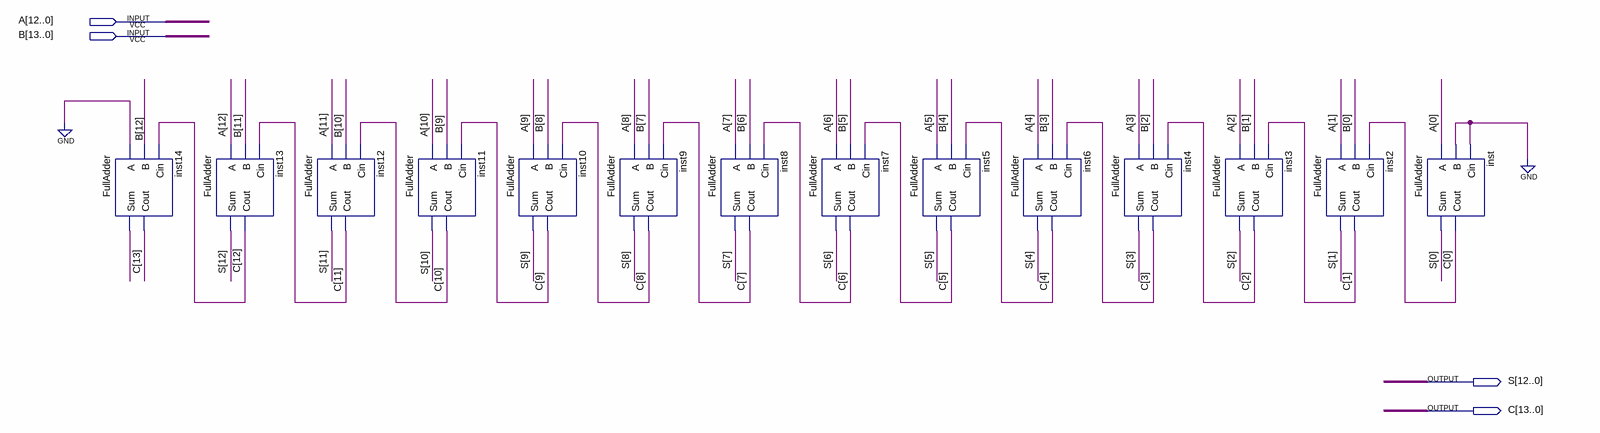
[diagram p0: schematic sheet]
// Quartus schematic CRA_wordslice.bdf as structural Verilog: 14 symbols, 4 pins
module CRA_wordslice (
  input  [12:0] A,
  input  [13:0] B,
  output [12:0] S,
  output [13:0] C
);

  wire inst14_sum;

  FullAdder inst14 (.A(1'b0), .B(B[12]), .Cin(C[12]), .Sum(inst14_sum), .Cout(C[13]));
  FullAdder inst13 (.A(A[12]), .B(B[11]), .Cin(C[11]), .Sum(S[12]), .Cout(C[12]));
  FullAdder inst12 (.A(A[11]), .B(B[10]), .Cin(C[10]), .Sum(S[11]), .Cout(C[11]));
  FullAdder inst11 (.A(A[10]), .B(B[9]), .Cin(C[9]), .Sum(S[10]), .Cout(C[10]));
  FullAdder inst10 (.A(A[9]), .B(B[8]), .Cin(C[8]), .Sum(S[9]), .Cout(C[9]));
  FullAdder inst9 (.A(A[8]), .B(B[7]), .Cin(C[7]), .Sum(S[8]), .Cout(C[8]));
  FullAdder inst8 (.A(A[7]), .B(B[6]), .Cin(C[6]), .Sum(S[7]), .Cout(C[7]));
  FullAdder inst7 (.A(A[6]), .B(B[5]), .Cin(C[5]), .Sum(S[6]), .Cout(C[6]));
  FullAdder inst5 (.A(A[5]), .B(B[4]), .Cin(C[4]), .Sum(S[5]), .Cout(C[5]));
  FullAdder inst6 (.A(A[4]), .B(B[3]), .Cin(C[3]), .Sum(S[4]), .Cout(C[4]));
  FullAdder inst4 (.A(A[3]), .B(B[2]), .Cin(C[2]), .Sum(S[3]), .Cout(C[3]));
  FullAdder inst3 (.A(A[2]), .B(B[1]), .Cin(C[1]), .Sum(S[2]), .Cout(C[2]));
  FullAdder inst2 (.A(A[1]), .B(B[0]), .Cin(C[0]), .Sum(S[1]), .Cout(C[1]));
  FullAdder inst (.A(A[0]), .B(1'b0), .Cin(1'b0), .Sum(S[0]), .Cout(C[0]));
endmodule
